# EAGLE schematic IMU_Digital_Combo_Board _-_6_Degrees_of_Freedom_-_ITG3200_-_ADXL345 (EAGLE 6.4)
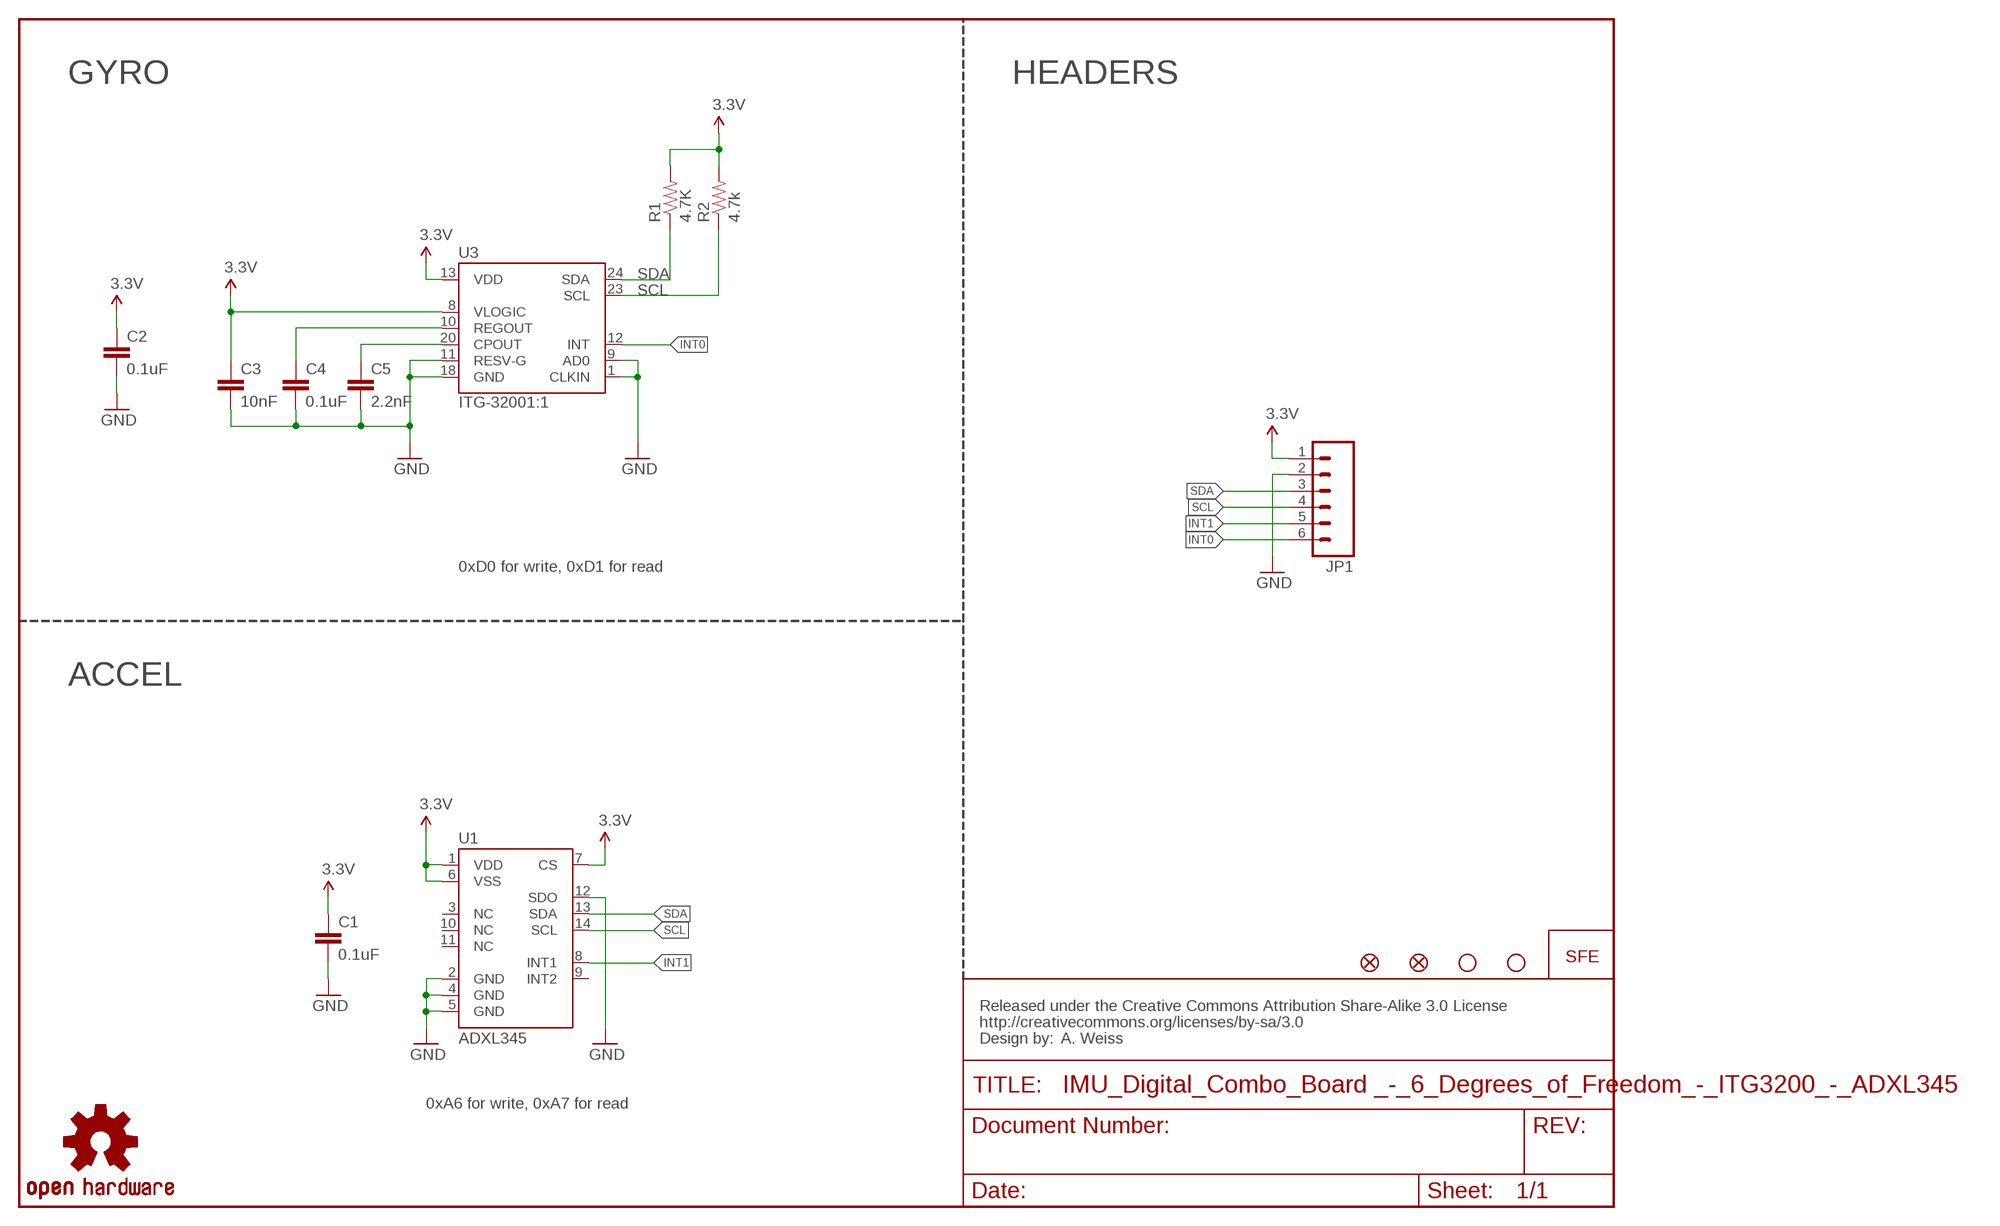
[diagram p0: schematic, sheet 1]

## Parts
C1  0.1uF  CAP0603-CAP  [0603-CAP]
C2  0.1uF  CAP0603-CAP  [0603-CAP]
C3  10nF  CAP0603-CAP  [0603-CAP]
C4  0.1uF  CAP0603-CAP  [0603-CAP]
C5  2.2nF  CAP0603-CAP  [0603-CAP]
JP1  M06SIP  [1X06]
JP2  STAND-OFF  [STAND-OFF]
JP3  LOGO-SFESK  [SFE-LOGO-FLAME]
JP4  FIDUCIAL1X2  [FIDUCIAL-1X2]
JP5  STAND-OFF  [STAND-OFF]
JP6  FIDUCIAL1X2  [FIDUCIAL-1X2]
R1  4.7K  RESISTOR0603-RES  [0603-RES]
R2  4.7k  RESISTOR0603-RES  [0603-RES]
U1  ADXL345  [LGA14]
U3  ITG-32001:1  [QFN-24_ITG3200_1:1]
U$1  CREATIVE_COMMONS  [CREATIVE_COMMONS]
U$2  OSHW-LOGOS  [OSHW-LOGO-S]

## Nets
3.3V: C1.1 C2.1 C3.1 JP1.1 R1.2 R2.2 U1.1(VDD) U1.6(VSS) U1.7(CS) U3.8(VLOGIC)
GND: C1.2 C2.2 C3.2 C4.2 C5.2 JP1.2 U1.2(GND) U1.4(GND) U1.5(GND) U1.12(SDO) U3.1(CLKIN) U3.9(AD0) U3.11(RESV-G) U3.18(GND)
INT0: JP1.6 U3.12(INT)
INT1: JP1.5 U1.8(INT1)
N$2: C5.1 U3.20(CPOUT)
N$3: C4.1 U3.10(REGOUT)
SCL: JP1.4 R2.1 U1.14(SCL) U3.23(SCL)
SDA: JP1.3 R1.1 U1.13(SDA)
Unconnected: U1.3(NC) U1.9(INT2) U1.10(NC) U1.11(NC) U3.13(VDD) U3.24(SDA)

## Notes on the sheet
- GYRO | HEADERS
- 0xD0 for write, 0xD1 for read
- ACCEL
- A. Weiss
- 0xA6 for write, 0xA7 for read

## Library data of the parts
C1-C5 = SparkFun:CAP: Capacitor Standard 0603 ceramic capacitor, and 0.1" leaded capacitor.
JP1 = SparkFun:M06: Header 6 Standard 6-pin 0.1" header. Use with straight break away headers (SKU : PRT-00116), right angle break away headers (PRT-00553), swiss pins (PRT-00743), machine pins (PRT-00117), and female headers (PRT-00115). Molex polarized connector foot print use with SKU : PRT-08094 with associated crimp pins and housings. NOTES ON THE VARIANTS LOCK and LOCK_LONGPADS... This footprint was designed to help hold the alignment of a through-hole component (i.e. 6-pin header) while soldering it into place. You may notice that each hole has been shifted either up or down by 0.005 of an inch from it's more standard position (which is a perfectly straight line). This slight alteration caused the pins (the squares in the middle) to touch the edges of the holes. Because they are alternating, it causes a "brace" to hold the component in place. 0.005 has proven to be the perfect amount of "off-center" position when using our standard breakaway headers. Although looks a little odd when you look at the bare footprint, once you have a header in there, the alteration is very hard to notice. Also, if you push a header all the way into place, it is covered up entirely on the bottom side. This idea of altering the position of holes to aid alignment will be further integrated into the Sparkfun Library for other footprints. It can help hold any component with 3 or more connection pins.
JP2 JP5 = SparkFun:STAND-OFF: Stand Off This is the mechanical footprint for a #4 phillips button head screw. Use the keepout ring to avoid running the screw head into surrounding components. SKU : PRT-00447
JP3 = SparkFun:LOGO-SFE: Spark Fun Electronics PCB Logo This is the standard Spark Fun Electronics PCB logo.
JP4 JP6 = SparkFun:FIDUCIAL: Fiducial Alignment Points Various fiducial points for machine vision alignment.
R1 R2 = SparkFun:RESISTOR: Resistor Basic schematic elements and footprints for 0603, 1206, and PTH resistors.
U1 = SparkFun:ADXL345
U3 = Testing:ITG-3200: ITG-3200 3-axis gyro, digital output, qfn24 package
U$1 = SparkFun:CREATIVE_COMMONS
U$2 = SparkFun:OSHW-LOGO: Open Source Hardware Logo This logo indicates the piece of hardware it is found on incorporates a OSHW license and/or adheres to the definition of open source hardware found here: http://freedomdefined.org/OSHW